# EAGLE design sensor_v8 (EAGLE 7.3.0)
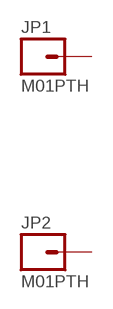
[diagram p0: schematic, sheet 1]

## Parts
JP1  M01PTH  [1X01]
JP2  M01PTH  [1X01]
Unconnected: JP1.1 JP2.1

## Library data of the parts
JP1 JP2 = SparkFun:M01: Header 1 Standard 1-pin 0.1" header. Use with straight break away headers (SKU : PRT-00116), right angle break away headers (PRT-00553), swiss pins (PRT-00743), machine pins (PRT-00117), and female headers (PRT-00115).

## Board
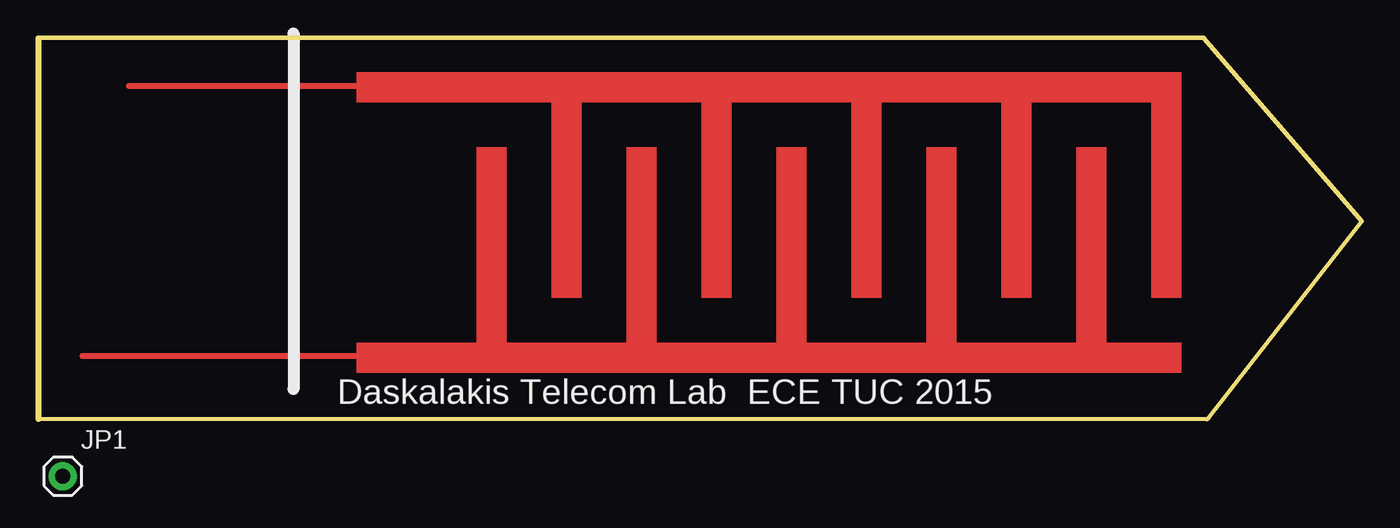
[diagram p1: board, top side]
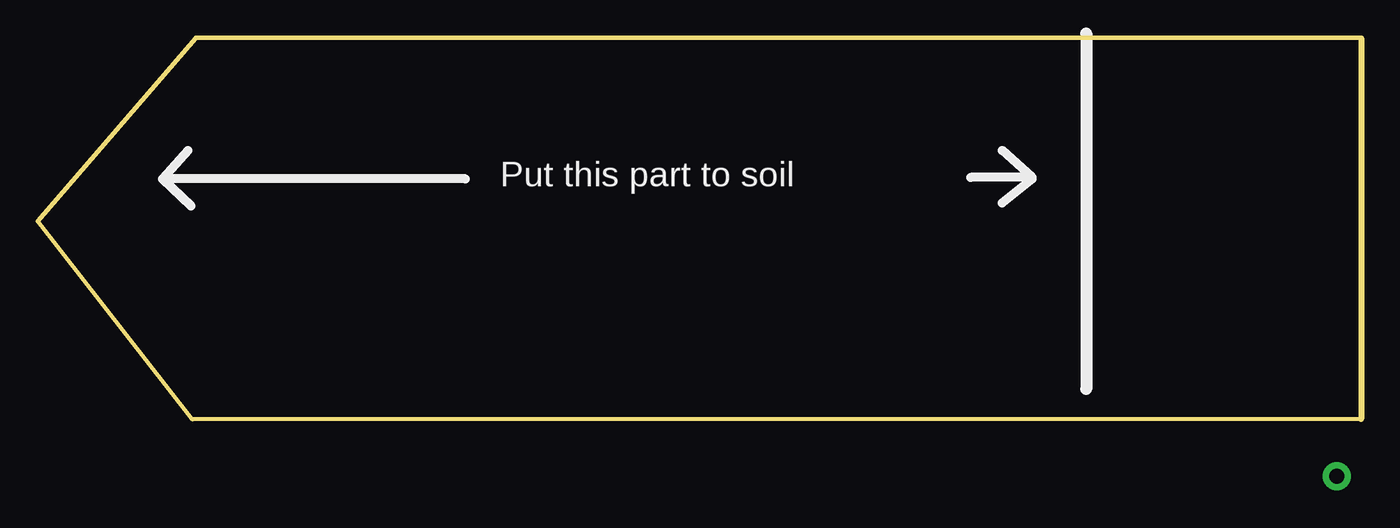
[diagram p2: board, bottom side, seen from below]

Size 88.32 x 25.43 mm. Coordinates in mm from the lower left corner, seen from the top.
Outline: 77.78,25.38 88.32,13.17 78.05,0.02
Outline: 77.77,25.42 0,25.43
Outline: 0.02,0.01 77.96,0
Outline: 0.06,25.38 0.06,0.01
Copper layers (1*16): Top 0.035mm / dielectric 1.5mm / Bottom 0.035mm
Design rules "default": minimum track width 10mil, minimum drill 24mil, track to track 8mil, track to pad 8mil, pad to pad 8mil, via to via 8mil, smd to smd 8mil, copper to edge 40mil, drill to drill 8mil, minimum pad ring 10mil, minimum via ring 8mil, stop-mask expansion 4mil, vias tented up to drill 0mil, thermal gap 10mil

### Footprints (pad centres in the part's own frame; a part is rotated, then mirrored left to right if it is on the bottom)
1X01 = drill 1.016 pad 1.88: 1 0,0

### Placement (x,y rotation side)
JP1  1.69,-3.81 0 top  (outside the outline)
JP2  1.69,-11.11 0 top  (outside the outline)

### Tracks (layer width: path | path; a pad name or v marks a point on that pad's centre or on a via)
N$1
  Top 0.406: 21.59,22.19 6.09,22.19
N$2
  Top 0.406: 22.59,4.19 2.99,4.19
(copper drawn outside any net)
  shapes: Top area x12

### Text on the board
tPlace: Daskalakis Telecom Lab ECE TUC 2015
bPlace: Put this part to soil